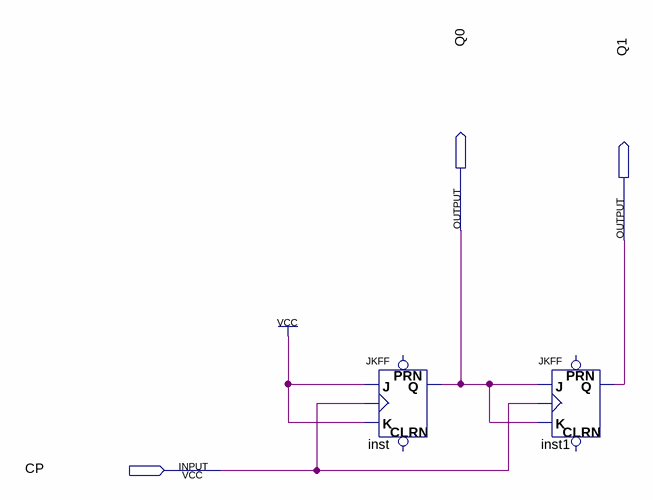
[diagram p0: schematic sheet]
// Quartus schematic num.bdf as structural Verilog: 2 symbols, 3 pins
module num (
  input  CP,
  output Q0,
  output Q1
);

  JKFF inst (.K(1'b1), .J(1'b1), .CLK(CP), .Q(Q0));  // open: PRN, CLRN
  JKFF inst1 (.K(Q0), .J(Q0), .CLK(CP), .Q(Q1));  // open: PRN, CLRN
endmodule
